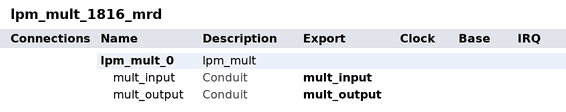
[diagram p0: system contents]
# Platform Designer (Qsys) system lpm_mult_1816_mrd, Arria 10 10AX115U3F45E2SGE3
# Parameters at their usual value, and those the tool derives, are not listed.
package require qsys
create_system lpm_mult_1816_mrd
set_project_property DEVICE_FAMILY {Arria 10}
set_project_property DEVICE 10AX115U3F45E2SGE3

add_instance lpm_mult_0 lpm_mult 15.1
set_instance_property lpm_mult_0 AUTO_EXPORT true
set_instance_parameter_value lpm_mult_0 GUI_ACLR false
set_instance_parameter_value lpm_mult_0 GUI_AUTO_SIZE_RESULT 0
set_instance_parameter_value lpm_mult_0 GUI_B_IS_CONSTANT 0
set_instance_parameter_value lpm_mult_0 GUI_CLKEN false
set_instance_parameter_value lpm_mult_0 GUI_CONSTANT_B 0
set_instance_parameter_value lpm_mult_0 GUI_IMPLEMENTATION 1
set_instance_parameter_value lpm_mult_0 GUI_LATENCY 2
set_instance_parameter_value lpm_mult_0 GUI_OPTIMIZE 1
set_instance_parameter_value lpm_mult_0 GUI_PIPELINE 1
set_instance_parameter_value lpm_mult_0 GUI_SIGNED_MULT 1
set_instance_parameter_value lpm_mult_0 GUI_USE_MULT 1
set_instance_parameter_value lpm_mult_0 GUI_WIDTH_A 18
set_instance_parameter_value lpm_mult_0 GUI_WIDTH_B 16
set_instance_parameter_value lpm_mult_0 GUI_WIDTH_P 34

# exported interfaces
add_interface mult_input conduit end
set_interface_property mult_input EXPORT_OF lpm_mult_0.mult_input
add_interface mult_output conduit end
set_interface_property mult_output EXPORT_OF lpm_mult_0.mult_output

set_interconnect_requirement {$system} qsys_mm.clockCrossingAdapter HANDSHAKE
set_interconnect_requirement {$system} qsys_mm.enableEccProtection FALSE
set_interconnect_requirement {$system} qsys_mm.insertDefaultSlave FALSE
set_interconnect_requirement {$system} qsys_mm.maxAdditionalLatency 1

save_system lpm_mult_1816_mrd.qsys
